# Altium schematic sheet Encoder.SchDoc
size A
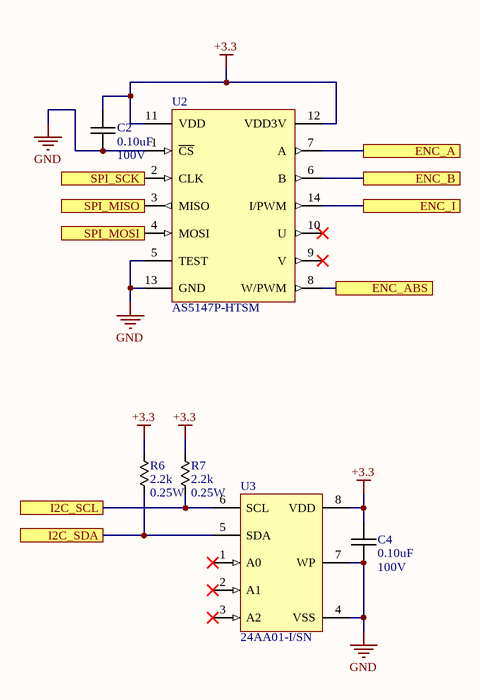
[diagram p0: Encoder.SchDoc]

## Parts
C2  Capacitance: 0.10uF  Voltage Rating: 100V  [chip_0805]  (hidden comment: cap_single_np)
C4  Capacitance: 0.10uF  Voltage Rating: 100V  [chip_0805]  (hidden comment: cap_single_np)
R6  Resistance: 2.2k  Power Rating: 0.25W  [chip_0603]  (hidden comment: res_single)
R7  Resistance: 2.2k  Power Rating: 0.25W  [chip_0603]  (hidden comment: res_single)
U2  AS5147P-HTSM  [TSSOP-14_0]
U3  Manufacturer PN: 24AA01-I/SN  [SO-8]  (hidden comment: 24AA01)

## Ports
ENC_A, ENC_ABS, ENC_B, ENC_I, I2C_SCL, I2C_SDA, SPI_MISO, SPI_MOSI, SPI_SCK

## Nets
+3.3: C2.1 C4.1 R6.1 R7.1 U2.11(VDD) U2.12(VDD3V) U3.8(VDD)
GND: C2.2 C4.2 U2.1(~{CS}) U2.5(TEST) U2.13(GND) U3.4(VSS) U3.7(WP)
ENC_A: U2.7(A) ; port ENC_A
ENC_ABS: U2.8(W/PWM) ; port ENC_ABS
ENC_B: U2.6(B) ; port ENC_B
ENC_I: U2.14(I/PWM) ; port ENC_I
I2C_SCL: R7.2 U3.6(SCL) ; port I2C_SCL
I2C_SDA: R6.2 U3.5(SDA) ; port I2C_SDA
SPI_MISO: U2.3(MISO) ; port SPI_MISO
SPI_MOSI: U2.4(MOSI) ; port SPI_MOSI
SPI_SCK: U2.2(CLK) ; port SPI_SCK

Not connected (* = marked no-connect by the designer): U2 9(V)* 10(U)*; U3 1(A0)* 2(A1)* 3(A2)*

## Library data of the parts
C2 C4 = CAP-00073: CAP, 0.10uF, 10%, 100V, X7R, 0805; Manufacturer: Murata; Manufacturer PN: GRM21BR72A104KAC4L; Tolerance: 10%; Part Number: CAP-00073; Type: X7R
R6 R7 = RES-00365: RES SMD 2.2K OHM 1% 1/4W 0603; Manufacturer: Panasonic; Manufacturer PN: ERJ-PA3F2201V; Tolerance: 1%; Part Number: RES-00365
U2 = MISC-00046: IC, 14-bit On-Axis Magnetic Rotary Position Sensor, Incremental, TSSOP-14; Manufacturer: AMS; Part Number: MISC-00046; Manufacturer PN: AS5147P-HTSM; Cost: 12.23
U3 = LOGIC-00028: EEPROM, 1K-bit, I2C, 400kHz, 24AA01, 8-SOIC; Manufacturer: Microchip; Part Number: LOGIC-00028; Cost: $0.20